# Altium schematic sheet StandaloneDevice.SchDoc
size A4; SheetNumber: 1; SheetTotal: 9
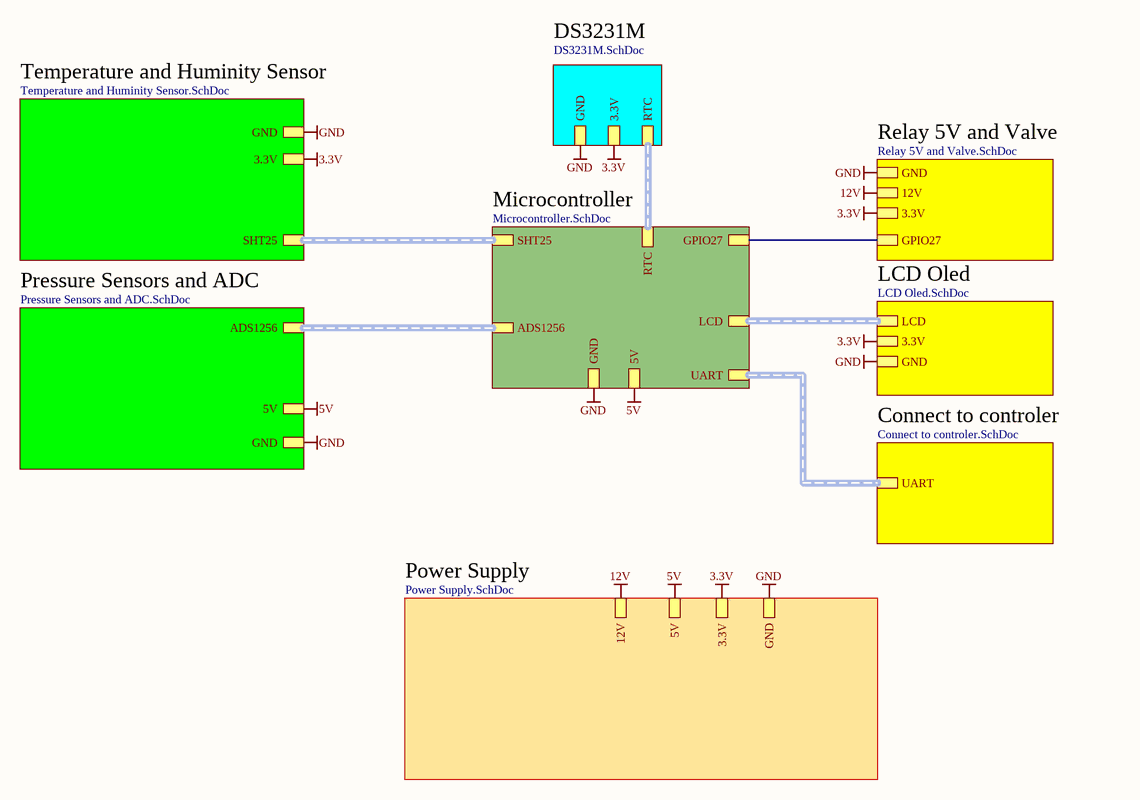
[diagram p0: StandaloneDevice.SchDoc]

## Sub-sheets
Connect to controler = Connect to controler.SchDoc: UART (harness UART)
DS3231M = DS3231M.SchDoc: RTC (harness RTC), 3.3V, GND
LCD Oled = LCD Oled.SchDoc: LCD (harness LCD), 3.3V, GND
Microcontroller = Microcontroller.SchDoc: GPIO27, ADS1256 (harness ADS1256), SHT25 (harness SHT25), LCD (harness LCD), RTC (harness RTC), UART (harness UART), GND, 5V
Power Supply = Power Supply.SchDoc: 12V, 5V, 3.3V, GND
Pressure Sensors and ADC = Pressure Sensors and ADC.SchDoc: ADS1256 (harness ADS1256), 5V, GND
Relay 5V and Valve = Relay 5V and Valve.SchDoc: GPIO27, GND, 12V, 3.3V
Temperature and Huminity Sensor = Temperature and Huminity Sensor.SchDoc: SHT25 (harness SHT25), GND, 3.3V

## Nets
3.3V: sheet Temperature and Huminity Sensor/3.3V, sheet Power Supply/3.3V, sheet Relay 5V and Valve/3.3V, sheet LCD Oled/3.3V, sheet DS3231M/3.3V
5V: sheet Pressure Sensors and ADC/5V, sheet Microcontroller/5V, sheet Power Supply/5V
12V: sheet Power Supply/12V, sheet Relay 5V and Valve/12V
GND: sheet Pressure Sensors and ADC/GND, sheet Temperature and Huminity Sensor/GND, sheet Microcontroller/GND, sheet Power Supply/GND, sheet Relay 5V and Valve/GND, sheet LCD Oled/GND, sheet DS3231M/GND
(unnamed): sheet Microcontroller/GPIO27, sheet Relay 5V and Valve/GPIO27

## Buses and harness runs
harness sheet Connect to controler/UART = sheet Microcontroller/UART
harness sheet DS3231M/RTC = sheet Microcontroller/RTC
harness sheet LCD Oled/LCD = sheet Microcontroller/LCD
harness sheet Microcontroller/ADS1256 = sheet Pressure Sensors and ADC/ADS1256
harness sheet Microcontroller/SHT25 = sheet Temperature and Huminity Sensor/SHT25